# Altium project Transmitter V2.PrjPcb
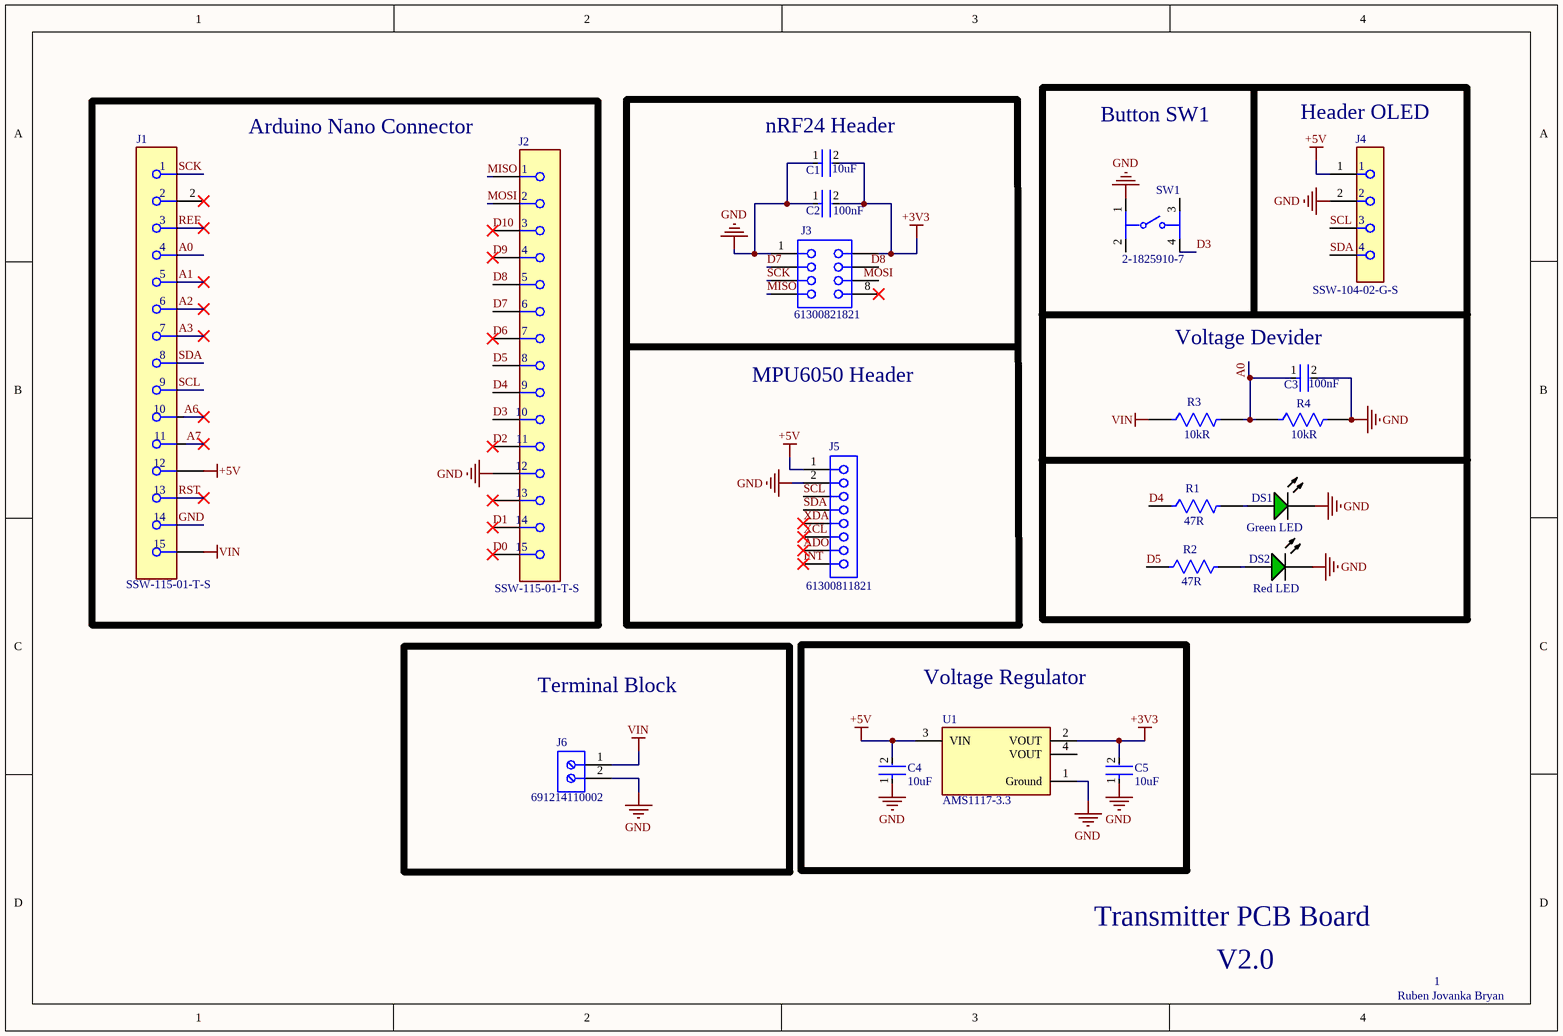
[diagram p0: Transmitter V2.SchDoc]
1 sheet, 19 parts. Net scope: global (net labels, ports and power ports of the same name join across sheets).
Board file: PCB_Transmitter_V2.PcbDoc

## Sheet Transmitter V2.SchDoc
size A4; SheetNumber: 1; SheetTotal: 1

### Parts
C1  10uF  [FP-C0805C-DG-MFG]
C2  100nF  [FP-CC0805-0_85-MFG]
C3  100nF  [FP-CC0805-0_85-MFG]
C4  10uF  [FP-C0805C-DG-MFG]
C5  10uF  [FP-C0805C-DG-MFG]
DS1  Green LED  [AVAG-HSMX-C170_V]
DS2  Red LED  [AVAG-HSMX-C170_V]
J1  SSW-115-01-T-S  [FP-SSW-115-01-T-S-MFG]
J2  SSW-115-01-T-S  [FP-SSW-115-01-T-S-MFG]
J3  61300821821  [61300821821]
J4  SSW-104-02-G-S  [FP-SSW-104-02-G-S-MFG]
J5  61300811821  [61300811821]
J6  691214110002  [691214110002]
R1  47R  [FP-RC1206-MFG]
R2  47R  [FP-RC1206-MFG]
R3  10kR  [FP-RC1206-MFG]
R4  10kR  [FP-RC1206-MFG]
SW1  2-1825910-7  [FP-2-1825910-7-MFG]
U1  AMS1117-3.3  [FP-AMS1117-IPC_C]

### Blocks framed on the sheet
Arduino Nano Connector: J1 J2
Terminal Block: J6
Voltage Regulator: C4 C5 U1

### Nets
+3V3: C1.2 C2.2 C5.2 J3.2 U1.2(VOUT)
+5V: C4.2 J1.12 J4.1 J5.1 U1.3(VIN)
GND: C1.1 C2.1 C3.2 C4.1 C5.1 DS1.2(K) DS2.2(K) J1.14 J2.12 J3.1 J4.2 J5.2 J6.2 R4.2 SW1.1 U1.1(Ground)
VIN: J1.15 J6.1 R3.1
A0: C3.1 J1.4 R3.2 R4.1
A1: J1.5
A2: J1.6
A3: J1.7
A6: J1.10
A7: J1.11
ADO: J5.7
D0: J2.15
D1: J2.14
D2: J2.11
D3: J2.10 SW1.4
D4: J2.9 R1.1
D5: J2.8 R2.1
D6: J2.7
D7: J2.6 J3.3
D8: J2.5 J3.4
D9: J2.4
D10: J2.3
INT: J5.8
MISO: J2.1 J3.7
MOSI: J2.2 J3.6
REF: J1.3
RST: J1.13
SCK: J1.1 J3.5
SCL: J1.9 J4.3 J5.3
SDA: J1.8 J4.4 J5.4
XCL: J5.6
XDA: J5.5
NetDS1_1: DS1.1(A) R1.2
NetDS2_1: DS2.1(A) R2.2

Not connected (* = marked no-connect by the designer): J1 2*; J2 13*; J3 8*; SW1 2 3; U1 4(VOUT)

### Notes on the sheet
- (near C1) nRF24 Header
- Button SW1
- (near J4) Header OLED
- MPU6050 Header
- (near C3) Voltage Devider
- Transmitter PCB Board
- V2.0
- 1
- Ruben Jovanka Bryan

### Library data of the parts
C1 C4 C5 = CMP-2007-03243-2: CAP CER 10UF 10V X5R 0805; Manufacturer Part Number: C0805C106K8PACTU; Manufacturer: Kemet; 3DS Part Number: 220-00001; Tolerance: 10%; Temperature Coefficient: 15%; Material: Ceramic; Device Class L2: Capacitors; Device Class L1: Passive Components; ComponentLink2URL: https://content.kemet.com/datasheets/KEM_C1006_X5R_SMD.pdf; Height: 1.4mm; Lead Free: Yes; Digikey Description: CAP CER 10UF 10V X5R 0805; Octopart: https://octopart.com/c0805c106k8pactu-kemet-98697; Capacitance: 10uF; Value: 10uF; Temperature Range Low: -55°C; Temperature: -55°C to +85°C; Automotive: No; Mouser Description: CAP CER 10UF 10V X5R 0805; Ipc Land Pattern Name: CAPC200125X125; Temperature Range High: +85°C; Voltage: 10V; RoHS: TRUE; Device Class L3: Ceramic Capacitors; ComponentLink2Description: Datasheet; Voltage Rating: 10V; Package: C0805C-DG; Temperature Characteristic: X5R; Category: Cap
C2 C3 = CMP-1036-04402-6: CAP CER 0.1UF 16V X7R 0805; Manufacturer Part Number: CC0805KRX7R7BB104; Manufacturer: Yageo; Material: Ceramic; Tolerance: 0.1; Temperature: -30°C to +85°C; Lead Free: Yes; Footprint Url: http://www.yageo.com/exep/pages/download/literatures/UPY-C_GEN_24.pdf; Voltage Rating: 16 V; Package: CC0805-0.85; RoHS: TRUE; Digikey Description: CAP CER 0.1UF 16V X7R 0805; Category: Cap; Octopart: https://octopart.com/cc0805krx7r7bb104-yageo-39467769; Capacitance: 100 nF; Device Class L3: Ceramic Capacitors; ComponentLink2URL: http://www.yageo.com/documents/recent/UPY-GPHC_Y5V_6.3V-to-50V_8.pdf; Value: 100 nF; Temperature Range Low: -30°C; Mouser Description: Multilayer Ceramic Capacitors MLCC - SMD/SMT 100nF 16V X7R 10%; Automotive: No; Device Class L2: Capacitors; Height: 0.95mm; ComponentLink2Description: Datasheet; Temperature Characteristic: X7R; Ipc Land Pattern Name: CAPC200125X85; Device Class L1: Passive Components; Temperature Range High: +85°C
DS1 DS2 = CMP-2000-05062-1: Chip LED, Green, 2.2 V, -40 to 85 degC, 2-Pin SMD, Pb-Free, Tape and Reel; Manufacturer: Avago; No. of Pins: 2; Peak Wavelength: 570nm; SVHC: NoSVHC(16-Jun-2014); Dominant Wavelength: 572nm; Forward Current If: 20mA; Viewing Angle: 170deg; Lens Shape: Rectangular; PIV Max: 5V; External Width: 1.25mm; LED Type: Standard; External Depth: 0.8mm; Opto Mounting Orientation: Top; Luminous Intensity: 15mcd; Luminous Intensity Min: 4mcd; Forward Voltage VF Max: 2.6V; External Length / Height: 2mm; Bulb Size: 1.25mmx1.4mm; Light Area Height: 1mm; Voltage Vf Typ: 2.2V; Operating Temperature Max: 85degC; Datasheet Version: Oct-08; MSL: MSL2A-4weeks; Peak Forward Current: 20mA; Package Description: 2-Pin Surface Mount Device, Body 2 x 1.25 mm, Height 0.8 mm; Datasheet URL: https://datasheet.ciiva.com/29280/180495-da-01-en-chip-led-hsmg-c170-gelb-gruen-29280971.pdf; Storage Temperature Min: -40degC; LED Colour: Green; Wavelength Typ: 570nm; Mounting Type: SMD; Forward Current If Max: 20mA; Dominant Wavelength Typ: 572nm; LED Mounting: SMD; Operating Temperature Range: -30degCto+85degC; Operating Temperature Min: -30degC; Manufacturer URL: http://www.avagotech.com/; Packaging: CutTape; Luminous Intensity Typ: 15mcd; Package Reference: HSMX-C170; Storage Temperature Max: 85degC; Opto Case Style: SMD; Forward Voltage: 2.2V
J1 J2 = CMP-02766-001723-1: CONN RCPT 15POS 0.1 TIN PCB; Connector Type: Receptacle; Max Voltage Rating (AC): 550V; Mating Cycles: 100; Number of Positions: 15; Pitch: 0.1inch; Max Current Rating: 6.9A; Contact Resistance: 10mR; Contact Type: Female Socket; Color: Black; Depth: 2.41mm; Radiation Hardening: No; Orientation: Straight; Termination: Solder; Series: SSW; Lead Free: Lead Free; Min Operating Temperature: -55°C; Contact Plating: Tin; Contact Material: Bronze; Max Operating Temperature: 105°C; Mount: Through Hole; Packaging: Bulk; Gender: Receptacle; Housing Material: Polymer; RoHS Compliant: Yes; Length: 38.61mm; Number of Rows: 1; REACH SVHC: No SVHC; Width: 2.41mm; Number of Contacts: 15; Housing Color: Black
J3 = CMP-1502-01329-3: NexarPartId: 61924725; Operating Supply Voltage: 250V; Contact Resistance: 20mΩ; Gender: Female; Current Rating: 3A; RoHS: Non-Compliant; Lead Pitch: 2.54mm; Number of Pins: 8; Orientation: Vertical
J4 = CMP-00575-00296407-1: SSW-104-02-G-S Board to Board & Mezzanine Connectors Tiger Buy Socket Strip with PCB Tails, .100 Pitch; NexarPartId: 296407; Manufacturer Lifecycle Status: PRODUCTION; Gender: Receptacle; Pitch: 2.54mm; Number of Positions: 4; Contact Resistance: 10mΩ; Connector Type: Receptacle, Socket; Voltage Rating: 550V; Max Current Rating: 6.9A; Voltage Rating (DC): 655V; Voltage Rating (AC): 465V; Current Rating: 4.7A; RoHS: Compliant; Lead Pitch: 2.54mm; Min Operating Temperature: -55°C; Housing Material: Polymer; Length: 10.67mm; Mount: Through Hole; Orientation: Straight; Lifecycle Status: Production; Lead Free: Lead Free; REACH SVHC: No SVHC; Number of Rows: 1; Contact Plating: Gold; Radiation Hardening: No; Max Operating Temperature: 125°C; Housing Color: Black; Height: 8.64mm; Contact Material: Bronze, Gold, Nickel; Width: 2.41mm; Number of Contacts: 4; Packaging: Bulk; Termination: Solder; Depth: 2.41mm; Max Voltage Rating (AC): 550V; Color: Black
J5 = CMP-1502-01327-3: NexarPartId: 61924723; Current Rating: 3A; Gender: Female; Contact Resistance: 20mΩ; Operating Supply Voltage: 250V; Lead Pitch: 2.54mm; RoHS: Non-Compliant; Orientation: Vertical; Number of Pins: 8
J6 = CMP-1502-02464-2: NexarPartId: 18818288; Plating: Brass, Steel; Current: 10A; Pitch: 3.5052mm; Number of Levels: 1; Number of Contacts: 2; Wire Gauge (Min): 16AWG; Voltage: 300V; Wire Gauge (Max): 24AWG; Stripping Length: -6mm; Number of Pins: 2; Number of Rows: 1; REACH SVHC: Unknown; RoHS: Compliant; Housing Material: Nylon; Termination: Screw; Mount: Through Hole; Contact Plating: Brass, Tin; Number of Positions Per Level: 2; Color: Blue, Green; Width: 7.9mm; Voltage Rating: 300V; Length: 7.4mm; Current Rating: 10A; Wire/Cable Gauge: 24AWG; Packaging: Box; Max Operating Temperature: 105°C; Lead Pitch: 3.5mm; Height: 8.7mm; Contact Material: Brass; Min Operating Temperature: -40°C
R1-R4 = CMP-2100-03681-2: RES SMD 0 OHM JUMPER 1/4W 1206; Manufacturer Part Number: RC1206JR-070RL; Manufacturer: YAGEO; Voltage Rating: 200V; Temperature Coefficient: 300ppm/°C; Power Rating: 0.25W; Value: 0Ω; Tolerance: 5%; Temperature Range Low: -55°C; Category: Res; Automotive: No; Ipc Land Pattern Name: RESC310160X55; Device Class L1: Passive Components; Temperature: -55°C to +155°C; ComponentLink2URL: https://www.yageo.com/upload/media/product/productsearch/datasheet/rchip/PYu-RC_Group_51_RoHS_L_10.pdf; Lead Free: Yes; Height: 0.65mm; Footprint Url: https://www.yageo.com/upload/website/yageo_PYu-R_Mount_10_19050818_343.pdf; Package: RC1206; Digikey Description: RES SMD 0 OHM JUMPER 1/4W 1206; Temperature Range High: +155°C; Device Class L3: Chip SMD Resistors; Device Class L2: Resistors; Octopart: https://octopart.com/rc1206jr-070rl-yageo-40025601; Resistance: 0Ω; Series: RC; ComponentLink2Description: Datasheet; Composition: Thick Film; RoHS: TRUE; Mouser Description: Resistor: thick film; SMD; 1206; 0O; 0.25W; ±5%; -55÷155°C
SW1 = CMP-03402-000004-1: SWITCH TACTILE SPST-NO 0.05A 24V; Manufacturer: TE Connectivity; Contact Current Rating: 50mA; Operating Force: 160gf; Electromechanical Life: 100000Cycles; Contact Resistance: 100mΩ; ComponentLink2Description: Datasheet; Height: 13.3mm; Digikey Description: SWITCH TACTILE SPST-NO 0.05A 24V; Device Class L2: Switches; Category: Switch; Device Class L3: Pushbutton Switches; Manufacturer Part Number: 2-1825910-7; Device Class L1: Electromechanical; Mount: Through Hole; Temperature Range High: +85°C; ComponentLink2URL: https://www.te.com/commerce/DocumentDelivery/DDEController?Action=showdoc&DocId=Customer+Drawing%7F1825910%7FC10%7Fpdf%7FEnglish%7FENG_CD_1825910_C10.pdf%7F2-1825910-7; RoHS: TRUE; Temperature: -35°C to +85°C; Mouser Description: Switch Tactile OFF (ON) SPST Extended Round Button PC Pins 0.05A 24VDC 100000Cycles 1.57N Thru-Hole Loose; Automotive: No; Voltage Rating Dc: 24V; Package: 2-1825910-7; Lead Free: Yes; Octopart: https://octopart.com/2-1825910-7-te+connectivity-42270510; Temperature Range Low: -35°C; Throw Configuration: SPST-NO
U1 = CMP-209535-000001-1: LDO Voltage Regulators 1A, 3.3V; Manufacturer: Advanced Monolithic Systems; Dropout Voltage: 1.1V; Output Type: Fixed; Nominal Supply Current: 5mA; Max Power Dissipation: 1.2W; Max Supply Voltage: 15V; Number Of Outputs: 1; Standoff Height: 0.64mm; Max Junction Temp: +125°C; Height: 1.8mm; Package: AMS1117; Device Class L2: Power Management ICs; ComponentLink2Description: Datasheet; ComponentLink2URL: http://www.advanced-monolithic.com/pdf/ds1117.pdf; Category: IC; RoHS: TRUE; Automotive: No; Device Class L1: Integrated Circuits (ICs); Output Current: 1A; Device Class L3: Voltage Regulators - Linear; Temperature: -40°C to +125°C; Output Voltage: 3.3V; Manufacturer Part Number: AMS1117-3.3; Temperature Range Low: -40°C; Octopart: https://octopart.com/ams1117-3.3-advanced+monolithic+systems-25899300; Lead Free: Yes; Ipc Land Pattern Name: SOT229P700X180-4; Temperature Range High: +125°C